# Altium schematic sheet [01] - COVER PAGE.SchDoc
size A3; DocumentNumber: 1; SheetNumber: 1; SheetTotal: 18
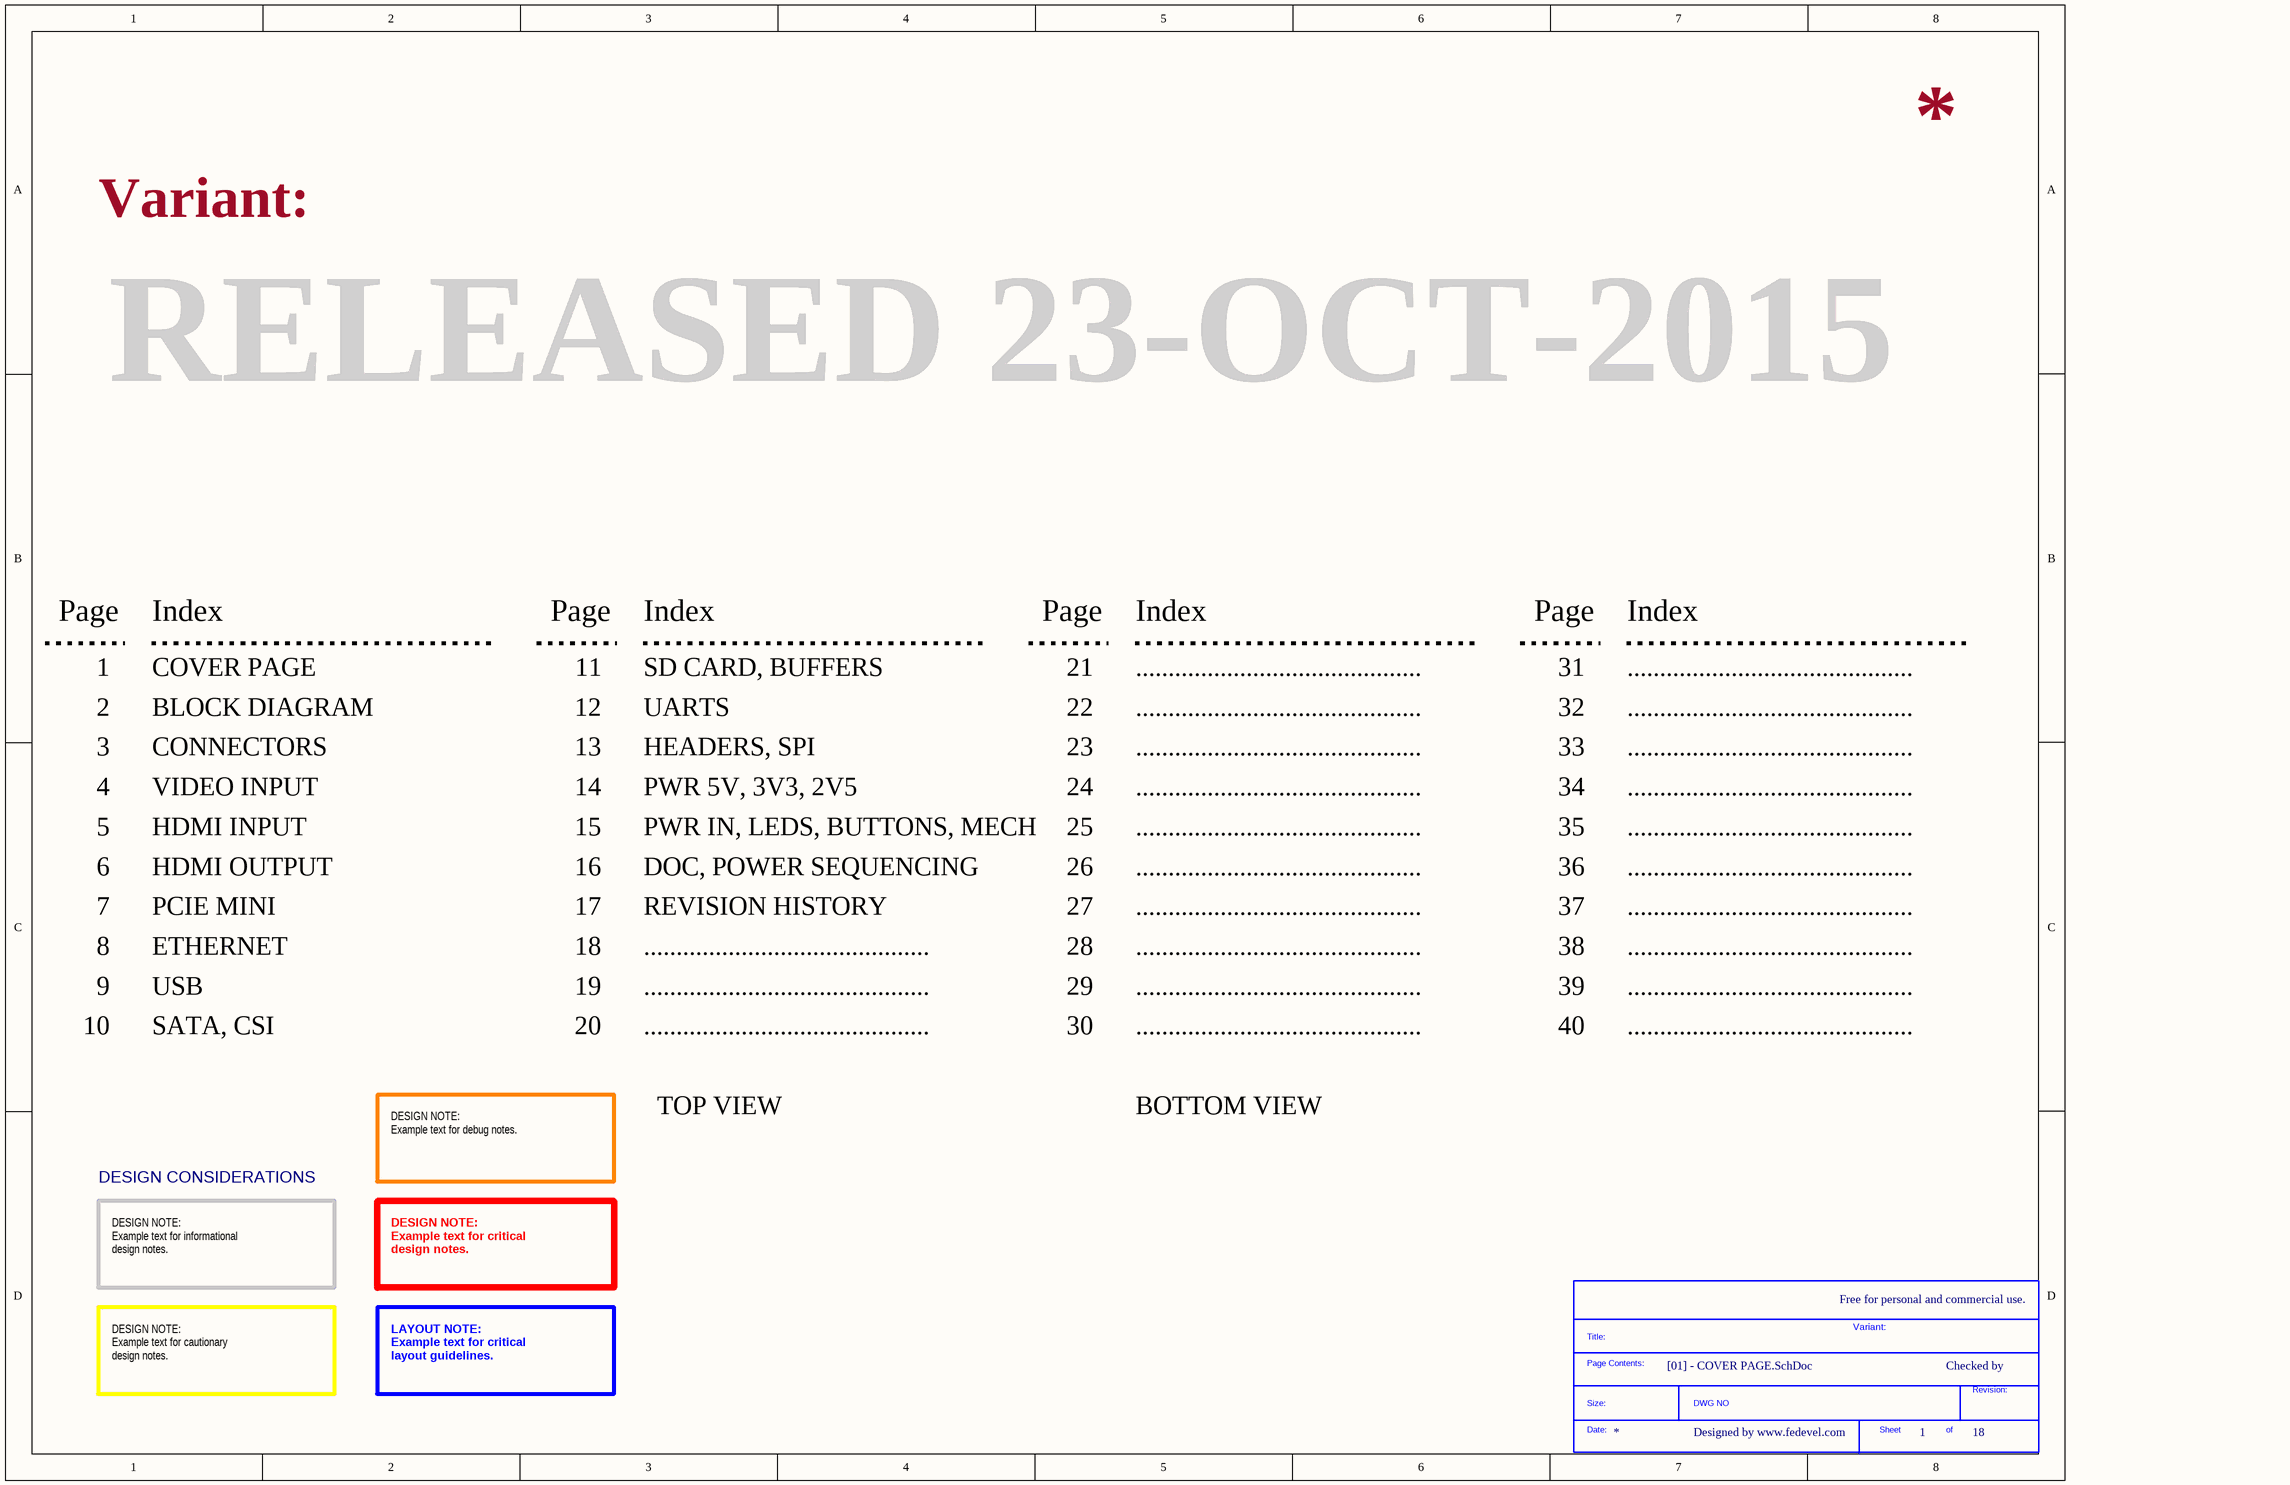
[diagram p0: [01] - COVER PAGE.SchDoc]

## Parts
*  SDTitleBlock  (value not drawn)  (graphical)

## Notes on the sheet
- Variant:
- RELEASED 23-OCT-2015
- Page
- Index
- 1
- COVER PAGE
- 11
- SD CARD, BUFFERS
- 21
- ............................................
- 31
- 2
- 3
- BLOCK DIAGRAM
- CONNECTORS
- 12
- 13
- UARTS
- HEADERS, SPI
- 22
- 23
- 32
- 33
- 4
- 5
- VIDEO INPUT
- HDMI INPUT
- 14
- 15
- PWR 5V, 3V3, 2V5
- PWR IN, LEDS, BUTTONS, MECH
- 24
- 25
- 34
- 35
- 6
- HDMI OUTPUT
- 16
- DOC, POWER SEQUENCING
- 26
- 36
- 7
- 8
- PCIE MINI
- ETHERNET
- 17
- 18
- REVISION HISTORY
- 27
- 28
- 37
- 38
- 9
- 10
- USB
- SATA, CSI
- 19
- 20
- 29
- 30
- 39
- 40
- DESIGN NOTE:
  Example text for debug notes.
- TOP VIEW
- BOTTOM VIEW
- DESIGN CONSIDERATIONS
- DESIGN NOTE:
  Example text for informational
  design notes.
- DESIGN NOTE:
  Example text for critical
  design notes.
- Free for personal and commercial use.
- Checked by
- DESIGN NOTE:
  Example text for cautionary
  design notes.
- LAYOUT NOTE:
  Example text for critical
  layout guidelines.
- Designed by www.fedevel.com
- (in symbol SDTitleBlock) Title:; Page Contents:; Revision:; Size:; DWG NO; Date:; Sheet; of